# EAGLE schematic Main board Giulia (EAGLE 6.6.0)
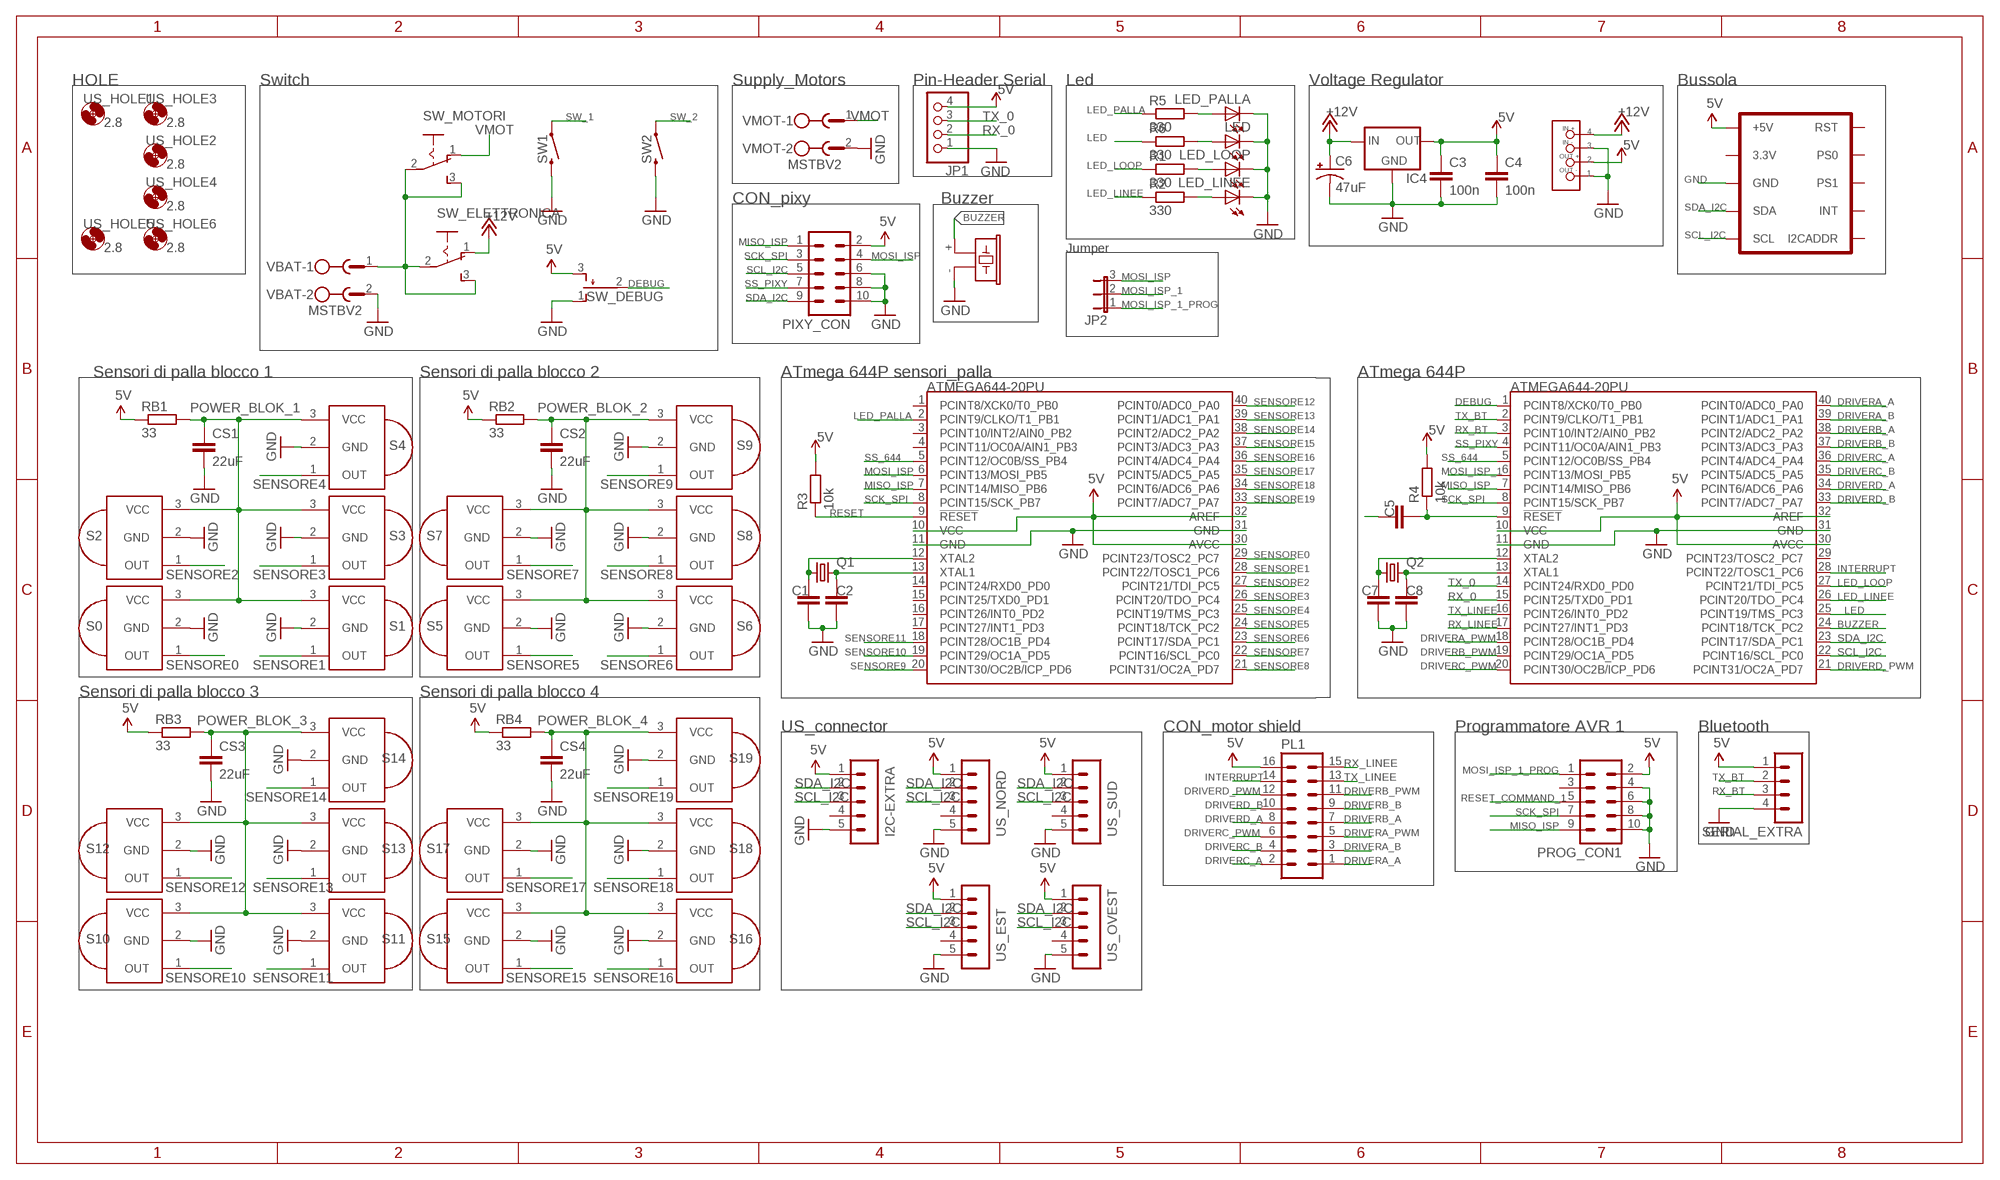
[diagram p0: schematic, sheet 1]

## Parts
C1  18p  C-EUC1206  [C1206]
C2  18p  C-EUC1206  [C1206]
C3  100n  C-EU050-025X075  [C050-025X075]
C4  100n  C-EU050-025X075  [C050-025X075]
C5  0.1uF  C-EUC1206  [C1206]
C6  47uF  CAP_POLPTH1  [CPOL-RADIAL-100UF-25V]
C7  18p  C-EUC1206  [C1206]
C8  18p  C-EUC1206  [C1206]
CS1  22uF  C-EUC1206  [C1206]
CS2  22uF  C-EUC1206  [C1206]
CS3  22uF  C-EUC1206  [C1206]
CS4  22uF  C-EUC1206  [C1206]
I2C-EXTRA  MA05-1  [MA05-1]
IC2  ATMEGA644-20PU  [DIL40]
IC3  ATMEGA644-20PU  [DIL40]
IC4  V_REG_78XXSIDE  [78XXL]
JP1  PINHD-1X4  [1X04]
JP2  JP2E  [JP2]
LED  LED3MM  [LED3MM]
LED_LINEE  LED3MM  [LED3MM]
LED_LOOP  LED3MM  [LED3MM]
LED_PALLA  LED3MM  [LED3MM]
PIXY_CON  10V  [10V]
PL1  16V  [16V]
PROG_CON1  10V  [10V]
Q1  CRYSTALHC49UV  [HC49U-V]
Q2  CRYSTALHC49UV  [HC49U-V]
R1  330  R-EU_M1206  [M1206]
R2  330  R-EU_M1206  [M1206]
R3  10k  R-EU_M1206  [M1206]
R4  10k  R-EU_M1206  [M1206]
R5  330  R-EU_M1206  [M1206]
R6  330  R-EU_M1206  [M1206]
RB1  33  R-EU_0207/10  [0207/10]
RB2  33  R-EU_0207/10  [0207/10]
RB3  33  R-EU_0207/10  [0207/10]
RB4  33  R-EU_0207/10  [0207/10]
S0  PNA460XM  [PNA460XM]
S1  PNA460XM  [PNA460XM]
S2  PNA460XM  [PNA460XM]
S3  PNA460XM  [PNA460XM]
S4  PNA460XM  [PNA460XM]
S5  PNA460XM  [PNA460XM]
S6  PNA460XM  [PNA460XM]
S7  PNA460XM  [PNA460XM]
S8  PNA460XM  [PNA460XM]
S9  PNA460XM  [PNA460XM]
S10  PNA460XM  [PNA460XM]
S11  PNA460XM  [PNA460XM]
S12  PNA460XM  [PNA460XM]
S13  PNA460XM  [PNA460XM]
S14  PNA460XM  [PNA460XM]
S15  PNA460XM  [PNA460XM]
S16  PNA460XM  [PNA460XM]
S17  PNA460XM  [PNA460XM]
S18  PNA460XM  [PNA460XM]
S19  PNA460XM  [PNA460XM]
SERIAL_EXTRA  MA04-1  [MA04-1]
SG1  F/CM12P  [F/CM12P]
SW1  SWITCH-MOMENTARY-2  [SWITCH_EVQ2]
SW2  SWITCH-MOMENTARY-2  [SWITCH_EVQ2]
SW_DEBUG  TL38PO  [TL3XPO]
SW_ELETTRONICA  255SB  [255SB]
SW_MOTORI  255SB  [255SB]
U$1  MINI3ADCDCLM2596  [MINI3ADCDCLM2595]
U$17  BNO055  [BNO055]
US_EST  MA05-1  [MA05-1]
US_HOLE1  2.8  MOUNT-HOLE2.8  [2,8]
US_HOLE2  2.8  MOUNT-HOLE2.8  [2,8]
US_HOLE3  2.8  MOUNT-HOLE2.8  [2,8]
US_HOLE4  2.8  MOUNT-HOLE2.8  [2,8]
US_HOLE5  2.8  MOUNT-HOLE2.8  [2,8]
US_HOLE6  2.8  MOUNT-HOLE2.8  [2,8]
US_NORD  MA05-1  [MA05-1]
US_OVEST  MA05-1  [MA05-1]
US_SUD  MA05-1  [MA05-1]
VBAT  MSTBV2  [MSTBV2]
VMOT  MSTBV2  [MSTBV2]

## Nets
5V [Power]: C3.1 C4.1 I2C-EXTRA.1 IC2.10(VCC) IC2.30(AVCC) IC2.32(AREF) IC3.10(VCC) IC3.30(AVCC) IC3.32(AREF) IC4.OUT JP1.4 PIXY_CON.2 PL1.16 PROG_CON1.2 R3.2 R4.2 RB1.1 RB2.1 RB3.1 RB4.1 SERIAL_EXTRA.1 SW_DEBUG.3(S) U$1.P$1(OUT+) U$1.P$8(OUT+) U$17.VIN(+5V) US_EST.1 US_NORD.1 US_OVEST.1 US_SUD.1
+12V [Power]: C6.1(+) IC4.IN SW_ELETTRONICA.1(O) U$1.P$2(IN1) U$1.P$7(IN1)
BUZZER: IC3.24(PCINT18/TCK_PC2) SG1.+
DEBUG: IC3.1(PCINT8/XCK0/T0_PB0) SW_DEBUG.2(P)
DRIVERA_A: IC3.40(PCINT0/ADC0_PA0) PL1.1
DRIVERA_B: IC3.39(PCINT1/ADC1_PA1) PL1.3
DRIVERA_PWM: IC3.18(PCINT28/OC1B_PD4) PL1.5
DRIVERB_A: IC3.38(PCINT2/ADC2_PA2) PL1.7
DRIVERB_B: IC3.37(PCINT3/ADC3_PA3) PL1.9
DRIVERB_PWM: IC3.19(PCINT29/OC1A_PD5) PL1.11
DRIVERC_A: IC3.36(PCINT4/ADC4_PA4) PL1.2
DRIVERC_B: IC3.35(PCINT5/ADC5_PA5) PL1.4
DRIVERC_PWM: IC3.20(PCINT30/OC2B/ICP_PD6) PL1.6
DRIVERD_A: IC3.34(PCINT6/ADC6_PA6) PL1.8
DRIVERD_B: IC3.33(PCINT7/ADC7_PA7) PL1.10
DRIVERD_PWM: IC3.21(PCINT31/OC2A_PD7) PL1.12
GND [Power]: C1.2 C2.2 C3.2 C4.2 C6.2(-) C7.2 C8.2 CS1.2 CS2.2 CS3.2 CS4.2 I2C-EXTRA.5 IC2.11(GND) IC2.31(GND) IC3.11(GND) IC3.31(GND) IC4.GND JP1.1 LED.K(C) LED_LINEE.K(C) LED_LOOP.K(C) LED_PALLA.K(C) PIXY_CON.6 PIXY_CON.8 PIXY_CON.10 PROG_CON1.4 PROG_CON1.6 PROG_CON1.8 PROG_CON1.10 S0.2(GND) S1.2(GND) S2.2(GND) S3.2(GND) S4.2(GND) S5.2(GND) S6.2(GND) S7.2(GND) S8.2(GND) S9.2(GND) S10.2(GND) S11.2(GND) S12.2(GND) S13.2(GND) S14.2(GND) S15.2(GND) S16.2(GND) S17.2(GND) S18.2(GND) S19.2(GND) SERIAL_EXTRA.4 SG1.- SW1.P$2 SW2.P$2 SW_DEBUG.1(O) U$1.P$3(IN2) U$1.P$4(OUT-) U$1.P$5(IN2) U$1.P$6(OUT-) U$17.GND US_EST.5 US_NORD.5 US_OVEST.5 US_SUD.5 VBAT.2 VMOT.2
INTERRUPT: IC3.28(PCINT22/TOSC1_PC6) PL1.14
LED: IC3.25(PCINT19/TMS_PC3) R6.1
LED_LINEE: IC3.26(PCINT20/TDO_PC4) R2.1
LED_LOOP: IC3.27(PCINT21/TDI_PC5) R1.1
LED_PALLA: IC2.2(PCINT9/CLKO/T1_PB1) R5.1
MISO_ISP: IC2.7(PCINT14/MISO_PB6) IC3.7(PCINT14/MISO_PB6) PIXY_CON.1 PROG_CON1.9
MOSI_ISP: IC2.6(PCINT13/MOSI_PB5) JP2.3 PIXY_CON.4
MOSI_ISP_1: IC3.6(PCINT13/MOSI_PB5) JP2.2
MOSI_ISP_1_PROG: JP2.1 PROG_CON1.1
N$1: C1.1 IC2.12(XTAL2) Q1.1
N$3: C2.1 IC2.13(XTAL1) Q1.2
N$5: LED.A R6.2
N$6: LED_LOOP.A R1.2
N$7: SW_ELETTRONICA.2(P) SW_ELETTRONICA.3(S) SW_MOTORI.2(P) SW_MOTORI.3(S) VBAT.1
N$9: C7.1 IC3.12(XTAL2) Q2.1
N$16: C8.1 IC3.13(XTAL1) Q2.2
N$17: LED_PALLA.A R5.2
N$21: LED_LINEE.A R2.2
N$58 [Power]: C5.2 IC3.9(!RESET) R4.1
POWER_BLOK_1: CS1.1 RB1.2 S0.3(VCC) S1.3(VCC) S2.3(VCC) S3.3(VCC) S4.3(VCC)
POWER_BLOK_2: CS2.1 RB2.2 S5.3(VCC) S6.3(VCC) S7.3(VCC) S8.3(VCC) S9.3(VCC)
POWER_BLOK_3: CS3.1 RB3.2 S10.3(VCC) S11.3(VCC) S12.3(VCC) S13.3(VCC) S14.3(VCC)
POWER_BLOK_4: CS4.1 RB4.2 S15.3(VCC) S16.3(VCC) S17.3(VCC) S18.3(VCC) S19.3(VCC)
RESET [Power]: IC2.9(!RESET) R3.1
RESET_COMMAND_1: C5.1 PROG_CON1.5
RX_0: IC3.15(PCINT25/TXD0_PD1) JP1.2
RX_BT: IC3.3(PCINT10/INT2/AIN0_PB2) SERIAL_EXTRA.3
RX_LINEE: IC3.17(PCINT27/INT1_PD3) PL1.15
SCK_SPI: IC2.8(PCINT15/SCK_PB7) IC3.8(PCINT15/SCK_PB7) PIXY_CON.3 PROG_CON1.7
SCL_I2C: I2C-EXTRA.3 IC3.22(PCINT16/SCL_PC0) PIXY_CON.5 U$17.SCL US_EST.3 US_NORD.3 US_OVEST.3 US_SUD.3
SDA_I2C: I2C-EXTRA.2 IC3.23(PCINT17/SDA_PC1) PIXY_CON.9 U$17.SDA US_EST.2 US_NORD.2 US_OVEST.2 US_SUD.2
SENSORE0: IC2.29(PCINT23/TOSC2_PC7) S0.1(OUT)
SENSORE1: IC2.28(PCINT22/TOSC1_PC6) S1.1(OUT)
SENSORE2: IC2.27(PCINT21/TDI_PC5) S2.1(OUT)
SENSORE3: IC2.26(PCINT20/TDO_PC4) S3.1(OUT)
SENSORE4: IC2.25(PCINT19/TMS_PC3) S4.1(OUT)
SENSORE5: IC2.24(PCINT18/TCK_PC2) S5.1(OUT)
SENSORE6: IC2.23(PCINT17/SDA_PC1) S6.1(OUT)
SENSORE7: IC2.22(PCINT16/SCL_PC0) S7.1(OUT)
SENSORE8: IC2.21(PCINT31/OC2A_PD7) S8.1(OUT)
SENSORE9: IC2.20(PCINT30/OC2B/ICP_PD6) S9.1(OUT)
SENSORE10: IC2.19(PCINT29/OC1A_PD5) S10.1(OUT)
SENSORE11: IC2.18(PCINT28/OC1B_PD4) S11.1(OUT)
SENSORE12: IC2.40(PCINT0/ADC0_PA0) S12.1(OUT)
SENSORE13: IC2.39(PCINT1/ADC1_PA1) S13.1(OUT)
SENSORE14: IC2.38(PCINT2/ADC2_PA2) S14.1(OUT)
SENSORE15: IC2.37(PCINT3/ADC3_PA3) S15.1(OUT)
SENSORE16: IC2.36(PCINT4/ADC4_PA4) S16.1(OUT)
SENSORE17: IC2.35(PCINT5/ADC5_PA5) S17.1(OUT)
SENSORE18: IC2.34(PCINT6/ADC6_PA6) S18.1(OUT)
SENSORE19: IC2.33(PCINT7/ADC7_PA7) S19.1(OUT)
SS_644: IC2.5(PCINT12/OC0B/SS_PB4) IC3.5(PCINT12/OC0B/SS_PB4)
SS_PIXY: IC3.4(PCINT11/OC0A/AIN1_PB3) PIXY_CON.7
SW_1: SW1.P$1
SW_2: SW2.P$1
TX_0: IC3.14(PCINT24/RXD0_PD0) JP1.3
TX_BT: IC3.2(PCINT9/CLKO/T1_PB1) SERIAL_EXTRA.2
TX_LINEE: IC3.16(PCINT26/INT0_PD2) PL1.13
VMOT [Power]: SW_MOTORI.1(O) VMOT.1
Unconnected: I2C-EXTRA.4 IC2.1(PCINT8/XCK0/T0_PB0) IC2.3(PCINT10/INT2/AIN0_PB2) IC2.4(PCINT11/OC0A/AIN1_PB3) IC2.14(PCINT24/RXD0_PD0) IC2.15(PCINT25/TXD0_PD1) IC2.16(PCINT26/INT0_PD2) IC2.17(PCINT27/INT1_PD3) IC3.29(PCINT23/TOSC2_PC7) PROG_CON1.3 U$17.3V3(3.3V) U$17.ADR(I2CADDR) U$17.INT U$17.PS0 U$17.PS1 U$17.RST US_EST.4 US_NORD.4 US_OVEST.4 US_SUD.4

## Notes on the sheet
- HOLE | Switch | Supply_Motors | Pin-Header Serial | Led | Voltage Regulator | Bussola
- CON_pixy | Buzzer
- Jumper
- Sensori di palla blocco 1 | Sensori di palla blocco 2 | ATmega 644P sensori_palla | ATmega 644P
- Sensori di palla blocco 3 | Sensori di palla blocco 4
- US_connector | CON_motor shield | Programmatore AVR 1 | Bluetooth

## Library data of the parts
C1-C5 C7 C8 CS1-CS4 = rcl:C-EU: CAPACITOR, European symbol
C6 = SparkFun:CAP_POL: Capacitor Polarized These are standard SMD and PTH capacitors. Normally 10uF, 47uF, and 100uF in electrolytic and tantalum varieties. Always verify the external diameter of the through hole cap, it varies with capacity, voltage, and manufacturer. The EIA devices should be standard.
I2C-EXTRA US_EST US_NORD US_OVEST US_SUD = con-lstb:MA05-1: PIN HEADER; OC_FARNELL: unknown; OC_NEWARK: unknown
IC2 IC3 = atmel:ATMEGA644-*PU: 8-bit Microcontroller with 64K Bytes In-System Programmable Flash Auto generated by make-symbol-device-package-bsdl.ulp Rev. 34 Source: http://www.atmel.com/dyn/resources/prod_documents/doc2593.pdf; MPN: ATMEGA644-20PU; OC_FARNELL: 1288340; OC_NEWARK: 23M5060
IC4 = SparkFun:V_REG_78XX: Voltage Regulator Standard 7805 5V regulator. IGO (Input Ground Output). Spark Fun Electronics SKU : COM-00107
JP1 = pinhead:PINHD-1X4: PIN HEADER
JP2 = jumper:JP2E: JUMPER
LED LED_LINEE LED_LOOP LED_PALLA = adafruit:LED: LED OSRAM: - CHIPLED LG R971, LG N971, LY N971, LG Q971, LY Q971, LO R971, LY R971 LH N974, LH R974 LS Q976, LO Q976, LY Q976 LO Q996 - Hyper CHIPLED LW Q18S LB Q993, LB Q99A, LB R99A - SideLED LS A670, LO A670, LY A670, LG A670, LP A670 LB A673, LV A673, LT A673, LW A673 LH A674 LY A675 LS A676, LA A676, LO A676, LY A676, LW A676 LS A679, LY A679, LG A679 - Hyper Micro SIDELED® LS Y876, LA Y876, LO Y876, LY Y876 LT Y87S - SmartLED LW L88C, LW L88S LB L89C, LB L89S, LG L890 LS L89K, LO L89K, LY L89K LS L896, LA L896, LO L896, LY L896 - TOPLED LS T670, LO T670, LY T670, LG T670, LP T670 LSG T670, LSP T670, LSY T670, LOP T670, LYG T670 LG T671, LOG T671, LSG T671 LB T673, LV T673, LT T673, LW T673 LH T674 LS T676, LA T676, LO T676, LY T676, LB T676, LH T676, LSB T676, LW T676 LB T67C, LV T67C, LT T67C, LS T67K, LO T67K, LY T67K, LW E67C LS E67B, LA E67B, LO E67B, LY E67B, LB E67C, LV E67C, LT E67C LW T67C LS T679, LY T679, LG T679 LS T770, LO T770, LY T770, LG T770, LP T770 LB T773, LV T773, LT T773, LW T773 LH T774 LS E675, LA E675, LY E675, LS T675 LS T776, LA T776, LO T776, LY T776, LB T776 LHGB T686 LT T68C, LB T68C - Hyper Mini TOPLED® LB M676 - Mini TOPLED Santana® LG M470 LS M47K, LO M47K, LY M47K Source: http://www.osram.convergy.de/
PIXY_CON PROG_CON1 = con-harting-v_Alfy:10V: CONNECTOR; OC_FARNELL: unknown; OC_NEWARK: unknown
PL1 = con-harting-v-modificata:16V: CONNECTOR; OC_FARNELL: unknown; OC_NEWARK: unknown
Q1 Q2 = SparkFun:CRYSTAL: Crystals Various standard crystals. Proven footprints. Spark Fun Electronics SKU : COM-00534
R1-R6 RB1-RB4 = rcl:R-EU_: RESISTOR, European symbol
S0 S1-S19 = adafruit:PNA460XM: IR 38KHz receiver PNA4602 and related receivers http://www.ladyada.net/library/pcb/eaglelibrary.html
SERIAL_EXTRA = con-lstb:MA04-1: PIN HEADER; OC_FARNELL: unknown; OC_NEWARK: unknown
SG1 = buzzer:F/CM12P: BUZZER Source: Buerklin; OC_FARNELL: unknown; OC_NEWARK: unknown
SW1 SW2 = SparkFun:SWITCH-MOMENTARY-2
SW_DEBUG = switch:TL38PO: TINY SWITCH ON OFF MOM Source: http://www2.produktinfo.conrad.com/datenblaetter/700000-724999/705152-da-01-de-Subminiaturschalter_TL_36YO.pdf
SW_ELETTRONICA SW_MOTORI = switch:255SB: SLIDING SWITCH Distributor Buerklin, 11G810
U$1 = mini 3A DC-DC LM2596:MINI3ADCDCLM2596
U$17 = BNO055:BNO055
US_HOLE1-US_HOLE6 = holes:MOUNT-HOLE: MOUNTING HOLE with drill center marker
VBAT VMOT = con-phoenix-508:MSTBV2: PHOENIX; MPN: MSTBV 2,5/2-GF-5.08; OC_FARNELL: 1792792; OC_NEWARK: 69R9845

## Net classes
0 default: width 0.152 mm
1 Power: width 0.406 mm, clearance 0.61 mm